# EAGLE design o32h (EAGLE 6.5.0)
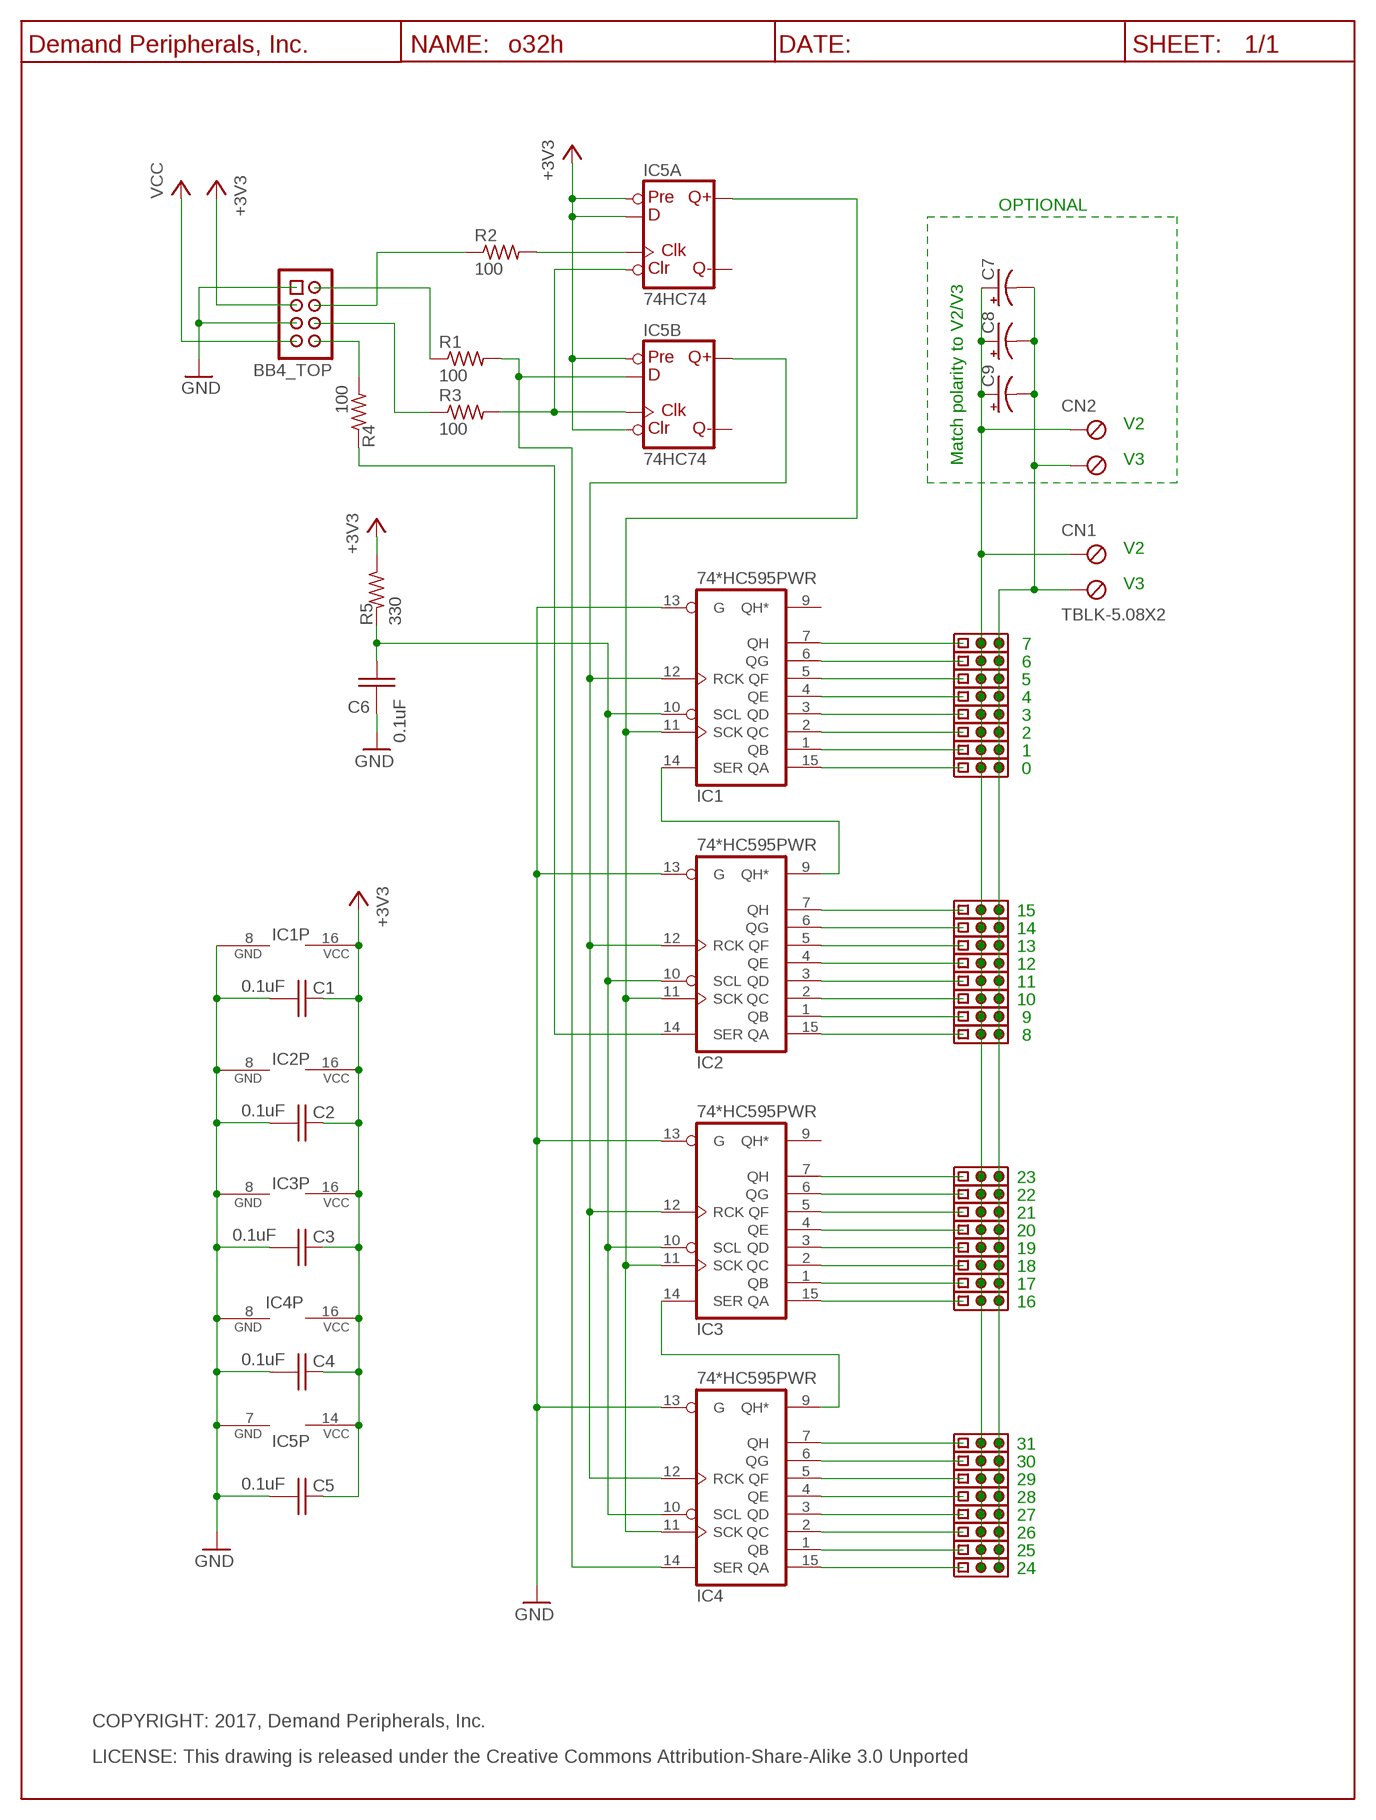
[diagram p0: schematic, sheet 1]

## Parts
BB4_TOP  Keyed_Pin_Header_4x2(0.1"x0.1")  HDR-4X2-SHR  [HDR-4X2]
C1  0.1uF  C0.1UF_C0603  [C0603]
C2  0.1uF  C0.1UF_C0603  [C0603]
C3  0.1uF  C0.1UF_C0603  [C0603]
C4  0.1uF  C0.1UF_C0603  [C0603]
C5  0.1uF  C0.1UF_C0603  [C0603]
C6  0.1uF  C0.1UF_C0603  [C0603]
C7  OPTIONAL  C1500UF35V_E7,5-16  [E7,5-16]
C8  OPTIONAL  C1500UF35V_E7,5-16  [E7,5-16]
C9  OPTIONAL  C1500UF35V_E7,5-16  [E7,5-16]
CN1  TBLK-5.08X2  TBLK-5.08-X2  [TBLK-5.08-X2]
CN2  TBLK-5.08X2  TBLK-5.08-X2  [TBLK-5.08-X2]
IC1  74*HC595PWR  74595  [SO16]
IC2  74*HC595PWR  74595  [SO16]
IC3  74*HC595PWR  74595  [SO16]
IC4  74*HC595PWR  74595  [SO16]
IC5  74HC74  74AHC74SS  [SO14]
R1  100  R100_R0603  [R0603]
R2  100  R100_R0603  [R0603]
R3  100  R100_R0603  [R0603]
R4  100  R100_R0603  [R0603]
R5  330  R330_R0603  [R0603]
U$2  DP_FRAME_P  [P_FRAME]
U$8  HDR-3X1  [HDR-3X1]
U$9  HDR-3X1  [HDR-3X1]
U$10  HDR-3X1  [HDR-3X1]
U$11  HDR-3X1  [HDR-3X1]
U$12  HDR-3X1  [HDR-3X1]
U$13  HDR-3X1  [HDR-3X1]
U$14  HDR-3X1  [HDR-3X1]
U$15  HDR-3X1  [HDR-3X1]
U$16  HDR-3X1  [HDR-3X1]
U$17  HDR-3X1  [HDR-3X1]
U$18  HDR-3X1  [HDR-3X1]
U$19  HDR-3X1  [HDR-3X1]
U$20  HDR-3X1  [HDR-3X1]
U$21  HDR-3X1  [HDR-3X1]
U$22  HDR-3X1  [HDR-3X1]
U$23  HDR-3X1  [HDR-3X1]
U$24  HDR-3X1  [HDR-3X1]
U$25  HDR-3X1  [HDR-3X1]
U$26  HDR-3X1  [HDR-3X1]
U$27  HDR-3X1  [HDR-3X1]
U$28  HDR-3X1  [HDR-3X1]
U$29  HDR-3X1  [HDR-3X1]
U$30  HDR-3X1  [HDR-3X1]
U$31  HDR-3X1  [HDR-3X1]
U$32  HDR-3X1  [HDR-3X1]
U$33  HDR-3X1  [HDR-3X1]
U$34  HDR-3X1  [HDR-3X1]
U$35  HDR-3X1  [HDR-3X1]
U$36  HDR-3X1  [HDR-3X1]
U$37  HDR-3X1  [HDR-3X1]
U$38  HDR-3X1  [HDR-3X1]
U$39  HDR-3X1  [HDR-3X1]

## Nets
+3V3: BB4_TOP.3 C1.1 C2.1 C3.1 C4.1 C5.1 IC1.16(VCC) IC2.16(VCC) IC3.16(VCC) IC4.16(VCC) IC5.2(A:D) IC5.4(A:PRE) IC5.10(B:PRE) IC5.13(B:CLR) IC5.14(P:VCC) R5.1
GND: BB4_TOP.1 BB4_TOP.5 C1.2 C2.2 C3.2 C4.2 C5.2 C6.2 IC1.8(GND) IC1.13(G) IC2.8(GND) IC2.13(G) IC3.8(GND) IC3.13(G) IC4.8(GND) IC4.13(G) IC5.7(P:GND)
N$1: BB4_TOP.8 R4.2
N$2: IC1.7(QH) U$8.1
N$3: IC1.12(RCK) IC2.12(RCK) IC3.12(RCK) IC4.12(RCK) IC5.9(B:Q)
N$4: IC1.11(SCK) IC2.11(SCK) IC3.11(SCK) IC4.11(SCK) IC5.5(A:Q)
N$7: IC1.6(QG) U$9.1
N$8: IC1.5(QF) U$10.1
N$9: IC1.4(QE) U$11.1
N$10: IC1.3(QD) U$12.1
N$12: IC1.2(QC) U$13.1
N$13: IC1.1(QB) U$14.1
N$14: IC1.15(QA) U$15.1
N$15: IC2.7(QH) U$16.1
N$16: IC2.6(QG) U$17.1
N$17: IC2.5(QF) U$18.1
N$18: IC2.4(QE) U$19.1
N$19: IC2.3(QD) U$20.1
N$20: IC2.2(QC) U$21.1
N$21: IC2.1(QB) U$22.1
N$22: IC2.15(QA) U$23.1
N$23: IC3.7(QH) U$24.1
N$24: IC3.6(QG) U$25.1
N$25: IC3.5(QF) U$26.1
N$26: IC3.4(QE) U$27.1
N$28: IC3.3(QD) U$28.1
N$29: IC3.2(QC) U$29.1
N$30: BB4_TOP.2 R1.1
N$31: IC3.1(QB) U$30.1
N$34: IC5.3(A:CLK) R2.2
N$35: IC4.14(SER) IC5.12(B:D) R1.2
N$36: IC5.1(A:CLR) IC5.11(B:CLK) R3.2
N$37: IC2.14(SER) R4.1
N$38: BB4_TOP.6 R3.1
N$39: IC3.14(SER) IC4.9(QH*)
N$41: BB4_TOP.4 R2.1
N$65: IC3.15(QA) U$31.1
N$66: C6.1 IC1.10(SCL) IC2.10(SCL) IC3.10(SCL) IC4.10(SCL) R5.2
N$67: IC4.7(QH) U$32.1
N$76: IC4.6(QG) U$33.1
N$98: IC4.5(QF) U$34.1
N$99: IC4.4(QE) U$35.1
N$100: IC4.3(QD) U$36.1
N$101: IC4.2(QC) U$37.1
N$102: IC4.1(QB) U$38.1
N$103: IC4.15(QA) U$39.1
N$108: IC1.14(SER) IC2.9(QH*)
V2: C7.+ C8.+ C9.+ CN1.1(KL) CN2.1(KL) U$8.2 U$9.2 U$10.2 U$11.2 U$12.2 U$13.2 U$14.2 U$15.2 U$16.2 U$17.2 U$18.2 U$19.2 U$20.2 U$21.2 U$22.2 U$23.2 U$24.2 U$25.2 U$26.2 U$27.2 U$28.2 U$29.2 U$30.2 U$31.2 U$32.2 U$33.2 U$34.2 U$35.2 U$36.2 U$37.2 U$38.2 U$39.2
V3: C7.- C8.- C9.- CN1.2(KL1) CN2.2(KL1) U$8.3 U$9.3 U$10.3 U$11.3 U$12.3 U$13.3 U$14.3 U$15.3 U$16.3 U$17.3 U$18.3 U$19.3 U$20.3 U$21.3 U$22.3 U$23.3 U$24.3 U$25.3 U$26.3 U$27.3 U$28.3 U$29.3 U$30.3 U$31.3 U$32.3 U$33.3 U$34.3 U$35.3 U$36.3 U$37.3 U$38.3 U$39.3
VCC: BB4_TOP.7
Unconnected: IC1.9(QH*) IC3.9(QH*) IC5.6(A:!Q) IC5.8(B:!Q)

## Notes on the sheet
- OPTIONAL
- V2
- Match polarity to V2/V3 | V3
- V2
- V3
- 7
- 6
- 5
- 4
- 3
- 2
- 1
- 0
- 15
- 14
- 13
- 12
- 11
- 10
- 9
- 8
- 23
- 22
- 21
- 20
- 19
- 18
- 17
- 16
- 31
- 30
- 29
- 28
- 27
- 26
- 25
- 24
- COPYRIGHT: 2017, Demand Peripherals, Inc.
- LICENSE: This drawing is released under the Creative Commons Attribution-Share-Alike 3.0 Unported

## Library data of the parts
BB4_TOP = dpi-conn:HDR-4X2-SHR: Shrouded 4x2 pin header; VENDOR: Digikey; VENDOR-PART-NUM: 609-3530-ND
C1-C6 = dpi-passive:C0.1UF_: 0.1 uF Capacitor, 25V, X7R; VENDOR: Digikey; VENDOR-PART-NUM: 1276-1126-2-ND
C7-C9 = dpi-passive:C1500UF35V_: 1500uF polarized capacitor, 35 volts, general purpose; VENDOR: Digikey; VENDOR-PART-NUM: 399-6559-ND
CN1 CN2 = dpi-conn:TBLK-5.08-X2: Terminal Block, 5.08mm, x2, screw terminals; VENDOR: Digikey; VENDOR-PART-NUM: ED2609-ND
IC1-IC4 = dpi-transic:74*595: 8-bit SHIFT REGISTER, output latch; VENDOR: Digikey; VENDOR-PART-NUM: 74HC595D(BJ)CT-ND
IC5 = dpi-transic:74AHC74: Dual D type positive edge triggered FLIP FLOP, preset and clear; VENDOR: Digikey; VENDOR-PART-NUM: 568-4458-1-ND
R1-R4 = dpi-passive:R100_: 100 Ohm resistor, 1%, 0.1 watt; VENDOR: Digikey; VENDOR-PART-NUM: 311-100HRTR-ND
R5 = dpi-passive:R330_: 330 Ohm resistor, 1%, 0.1 watt; VENDOR: Digikey; VENDOR-PART-NUM: 311-330HRTR-ND
U$2 = dpi-sym:DP_FRAME_P: Portrait/Letter Document Frame
U$8-U$39 = dpi-conn:HDR-3X1: 3 pin header on 0.1 inch centers, no shroud, no lock; VENDOR: Digikey; VENDOR-PART-NUM: 952-2264-ND

## Board
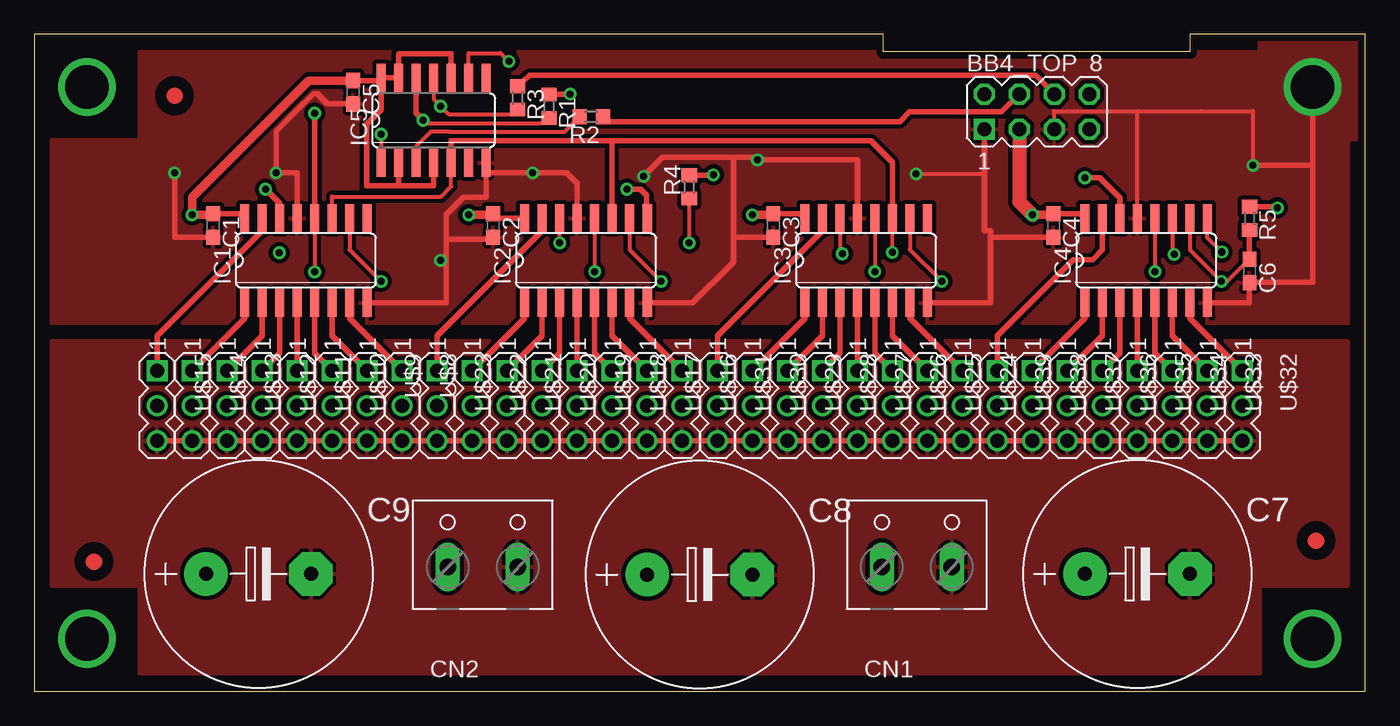
[diagram p1: board, top side]
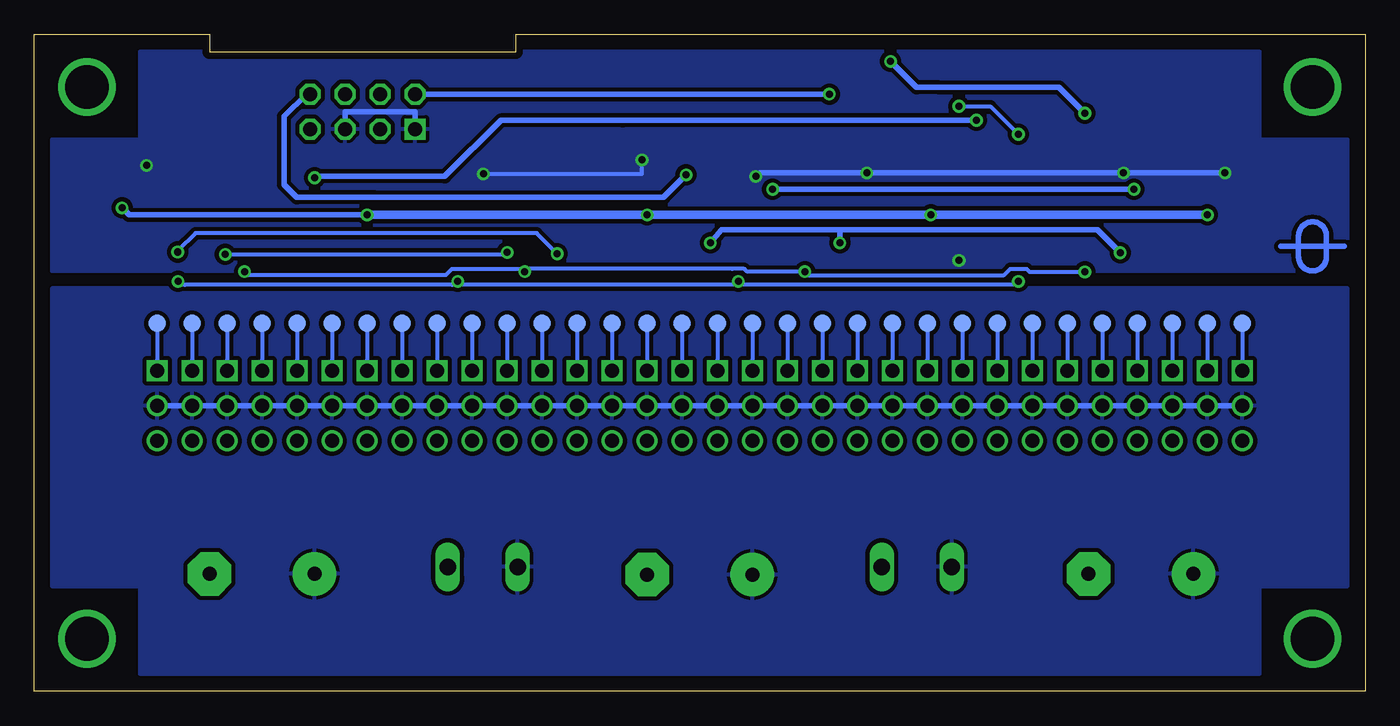
[diagram p2: board, bottom side, seen from below]

Size 96.52 x 47.62 mm. Coordinates in mm from the lower left corner, seen from the top.
Outline: 0,0 96.52,0 96.52,47.62 83.82,47.62 83.82,46.35 61.59,46.35 61.59,47.62 0,47.62 0,0
Copper layers (1*16): Top 0.035mm / dielectric 1.5mm / Bottom 0.035mm
Design rules "default *": minimum track width 10mil, minimum drill 20mil, track to track 12mil, track to pad 12mil, pad to pad 12mil, via to via 12mil, smd to smd 12mil, copper to edge 20mil, drill to drill 12mil, minimum pad ring 10mil, minimum via ring 8mil, stop-mask expansion 4mil, vias tented up to drill 25mil, thermal gap 10mil

### Footprints (pad centres in the part's own frame; a part is rotated, then mirrored left to right if it is on the bottom)
HDR-4X2 = drill 1.016 square: 1 -3.81,-1.27 | drill 1.016 octagon: 2 -3.81,1.27; 3 -1.27,-1.27; 4 -1.27,1.27; 5 1.27,-1.27; 6 1.27,1.27; 7 3.81,-1.27; 8 3.81,1.27
C0603 = smd 1.1 x 1: 1 -0.85,0; 2 0.85,0
E7,5-16 = drill 1.016 pad 3.15: + -3.81,0 | drill 1.016 pad 3.15 octagon: - 3.81,0
TBLK-5.08-X2 = drill 1.194 long: 1 -2.54,-0.127; 2 2.54,-0.127
TEST-POINT = smd 1.27 x 1.27: P1 0,0
SO16 = smd 0.66 x 2.032: 1 -4.445,-3.073; 2 -3.175,-3.073; 3 -1.905,-3.073; 4 -0.635,-3.073; 5 0.635,-3.073; 6 1.905,-3.073; 7 3.175,-3.073; 8 4.445,-3.073; 9 4.445,3.073; 10 3.175,3.073; 11 1.905,3.073; 12 0.635,3.073; 13 -0.635,3.073; 14 -1.905,3.073; 15 -3.175,3.073; 16 -4.445,3.073
SO14 = smd 0.66 x 2.032: 1 -3.81,-3.073; 2 -2.54,-3.073; 3 -1.27,-3.073; 4 0,-3.073; 5 1.27,-3.073; 6 2.54,-3.073; 7 3.81,-3.073; 8 3.81,3.073; 9 2.54,3.073; 10 1.27,3.073; 11 0,3.073; 12 -1.27,3.073; 13 -2.54,3.073; 14 -3.81,3.073
R0603 = smd 1 x 1.1: 1 -0.85,0; 2 0.85,0
HDR-3X1 = drill 1.016 square: 1 -2.54,0 | drill 1.016: 2 0,0; 3 2.54,0

### Placement (x,y rotation side)
BB4_TOP  72.71,42.04 0 top
C1  12.95,33.78 270 top
C2  33.27,33.78 270 top
C3  53.59,33.78 270 top
C4  73.91,33.78 270 top
C5  23.11,43.43 270 top
C6  88.14,30.48 270 top
C7  80.01,8.51 0 top
C8  48.26,8.46 0 top
C9  16.26,8.51 0 top
CN1  64.01,9.14 0 top
CN2  32.51,9.14 0 top
E$1  [TEST-POINT]  8.89,26.67 0 bottom
E$2  [TEST-POINT]  11.43,26.67 0 bottom
E$3  [TEST-POINT]  13.97,26.67 0 bottom
E$4  [TEST-POINT]  16.51,26.67 0 bottom
E$5  [TEST-POINT]  19.05,26.67 0 bottom
E$7  [TEST-POINT]  21.59,26.67 0 bottom
E$8  [TEST-POINT]  24.13,26.67 0 bottom
E$9  [TEST-POINT]  26.67,26.67 0 bottom
E$10  [TEST-POINT]  29.21,26.67 0 bottom
E$11  [TEST-POINT]  31.75,26.67 0 bottom
E$12  [TEST-POINT]  34.29,26.67 0 bottom
E$13  [TEST-POINT]  36.83,26.67 0 bottom
E$14  [TEST-POINT]  39.37,26.67 0 bottom
E$15  [TEST-POINT]  41.91,26.67 0 bottom
E$16  [TEST-POINT]  44.45,26.67 0 bottom
E$17  [TEST-POINT]  46.99,26.67 0 bottom
E$18  [TEST-POINT]  49.53,26.67 0 bottom
E$19  [TEST-POINT]  52.07,26.67 0 bottom
E$20  [TEST-POINT]  54.61,26.67 0 bottom
E$21  [TEST-POINT]  57.15,26.67 0 bottom
E$22  [TEST-POINT]  59.69,26.67 0 bottom
E$23  [TEST-POINT]  62.23,26.67 0 bottom
E$24  [TEST-POINT]  64.77,26.67 0 bottom
E$25  [P_FRAME]  0,0 0 top
E$26  [TEST-POINT]  67.31,26.67 0 bottom
E$27  [TEST-POINT]  69.85,26.67 0 bottom
E$28  [TEST-POINT]  72.39,26.67 0 bottom
E$29  [TEST-POINT]  74.93,26.67 0 bottom
E$30  [TEST-POINT]  77.47,26.67 0 bottom
E$31  [TEST-POINT]  80.01,26.67 0 bottom
E$32  [TEST-POINT]  82.55,26.67 0 bottom
E$33  [TEST-POINT]  85.09,26.67 0 bottom
E$34  [TEST-POINT]  87.63,26.67 0 bottom
IC1  19.68,31.24 0 top
IC2  40.01,31.24 0 top
IC3  60.33,31.24 0 top
IC4  80.64,31.24 0 top
IC5  28.96,41.4 0 top
R1  37.34,42.42 270 top
R2  40.39,41.66 180 top
R3  35.05,43.03 270 top
R4  47.5,36.58 90 top
R5  88.14,34.29 270 top
U$1  [P_FRAME]  0,0 0 top
U$2  -2.54,-2.54 0 top
U$4  [FIDUCIAL]  92.96,10.92 270 top
U$5  [FIDUCIAL]  4.32,9.4 0 top
U$6  [FIDUCIAL]  10.16,43.18 0 top
U$7  [DPI-1]  3.81,32.26 90 bottom
U$8  26.67,20.7 270 top
U$9  24.13,20.7 270 top
U$10  21.59,20.7 270 top
U$11  19.05,20.7 270 top
U$12  16.51,20.7 270 top
U$13  13.97,20.7 270 top
U$14  11.43,20.7 270 top
U$15  8.89,20.7 270 top
U$16  46.99,20.7 270 top
U$17  44.45,20.7 270 top
U$18  41.91,20.7 270 top
U$19  39.37,20.7 270 top
U$20  36.83,20.7 270 top
U$21  34.29,20.7 270 top
U$22  31.75,20.7 270 top
U$23  29.21,20.7 270 top
U$24  67.31,20.7 270 top
U$25  64.77,20.7 270 top
U$26  62.23,20.7 270 top
U$27  59.69,20.7 270 top
U$28  57.15,20.7 270 top
U$29  54.61,20.7 270 top
U$30  52.07,20.7 270 top
U$31  49.53,20.7 270 top
U$32  87.63,20.7 270 top
U$33  85.09,20.7 270 top
U$34  82.55,20.7 270 top
U$35  80.01,20.7 270 top
U$36  77.47,20.7 270 top
U$37  74.93,20.7 270 top
U$38  72.39,20.7 270 top
U$39  69.85,20.7 270 top

### Tracks (layer width: path | path; a pad name or v marks a point on that pad's centre or on a via)
+3V3  (via drill 0.51)
  Top 0.406: IC1.16 15.18,34.31 14.86,34.63 C1.1 | IC5.14 IC5.13 26.42,46.23 30.23,46.23 IC5.10 | C5.1 24.95,44.28 IC5.14 | IC5.2 26.42,36.65 | 26.42,36.65 24.08,36.65 24.08,41.1 25.15,42.16 IC5.14 | IC5.4 28.96,36.65 26.42,36.65 | C2.1 33.27,34.31 IC2.16 | C3.1 55.56,34.63 IC3.16 | C4.1 75.88,34.63 IC4.16 | R5.1 90.08,35.14 v90.17,35.05
  Top 0.61: C1.1 12.87,34.54 v11.43,34.54 11.43,35.81 19.9,44.28 C5.1 | v31.5,34.54 33.19,34.54 arc90 C2.1 | C3.1 53.51,34.54 v52.07,34.54 | C4.1 73.83,34.54 v72.39,34.54
  Top 1.016: BB4_TOP.3 71.44,35.5 v72.39,34.54
  Bottom 0.406: v90.17,35.05 89.66,34.54 v72.39,34.54
  Bottom 0.61: v11.43,34.54 v31.5,34.54 v52.07,34.54 v72.39,34.54
GND  (via drill 0.51, 3.17)
  Top 0.305: v63.96,37.52 68.9,37.52 68.9,37.64 | BB4_TOP.5 73.98,42.06 80.03,42.06 | 80.03,42.06 84.58,42.06 88.39,42.06 v88.39,38.12 | IC4.13 80.01,42.06 80.03,42.06
  Top 0.406: 29.84,32.77 29.84,34.54 31.11,35.81 32,35.81 32.77,35.81 IC5.7 32.77,37.59 v36.14,37.59 38.61,37.59 39.37,36.83 IC2.13 | 29.84,32.77 29.84,31.17 | 29.84,31.17 29.84,28.17 IC1.8 | C2.2 33.27,32.77 29.84,32.77 | IC1.13 19.05,37.59 v17.53,37.59 17.53,40.62 18.85,41.94 20.24,43.33 20.5,43.33 21.25,42.58 C5.2 | C1.2 10.16,32.93 v10.16,37.59 | BB4_TOP.1 68.9,37.64 68.9,33.4 69.34,33.4 | C4.2 69.34,32.93 69.34,33.4 | 69.34,33.4 69.34,28.17 IC3.8 | v92.71,43.81 92.73,43.81 92.73,37.77 | 92.73,37.77 92.73,29.64 88.14,29.64 C6.2 88.14,28.17 IC4.8 | v88.39,38.12 92.73,38.12 92.73,37.77 | v44.2,37.34 45.57,38.71 50.7,38.71 | v29.46,31.24 29.77,31.24 29.84,31.17 | C3.2 50.7,32.93 | 50.7,32.93 50.7,38.71 | IC2.8 47.75,28.17 50.52,30.94 50.7,31.11 50.7,32.93 | 50.7,38.71 52.45,38.71 v52.45,38.53 59.69,38.53 IC3.13
  Bottom 0.305: v63.96,37.52 52.45,37.52 v52.45,38.53
  Bottom 0.406: v10.16,37.59 v17.53,37.59 v36.14,37.59 43.94,37.59 v44.2,37.34 44.2,37.59 | 68.9,40.64 BB4_TOP.1 68.9,42.01 69.34,42.04 73.98,42.04 BB4_TOP.5
  pour Top: 1.27,26.67 1.27,40.01 7.62,40.01 7.62,46.35 88.9,46.35 88.9,47.12 96.01,47.12 96.01,40.01 95.25,40.01 95.25,26.67
  pour Bottom: 1.27,30.48 1.27,40.01 7.62,40.01 7.62,46.35 88.9,46.35 88.9,40.01 95.25,40.01 95.25,30.48
MOUNT0  (via drill 3.17 pad 3.17)
  other vias: 3.81,3.81
MOUNT1  (via drill 3.17 pad 3.17)
  other vias: 3.81,43.81
MOUNT6  (via drill 3.17 pad 3.17)
  other vias: 92.71,3.81
N$1  (via drill 0.51)
  Top 0.406: R4.2 49.24,37.43 v49.25,37.44
  Bottom 0.406: BB4_TOP.8 76.78,43.31 78.41,41.68 78.41,36.73 77.5,35.81 71.75,35.81 50.88,35.81 v49.25,37.44
N$2
  Top 0.406: IC1.7 22.86,27.05 U$8.1
N$3  (via drill 0.51)
  Top 0.305: IC3.12 v60.96,30.43 | IC1.12 v20.32,30.4 | IC2.12 v40.64,30.43 | IC4.12 v81.28,30.43 | IC5.9 31.5,46.28 33.76,46.28 33.81,46.28 v34.42,45.67
  Top 0.406: v20.32,41.91 IC1.12
  Bottom 0.305: v20.32,30.4 24.33,30.4 24.56,30.63 25.73,30.63 26.19,30.18 40.39,30.18 v40.64,30.43 44.83,30.43 45.01,30.61 45.03,30.63 45.9,30.63 60.76,30.63 v60.96,30.43 60.96,30.63 65.38,30.63 66.24,30.63 66.67,30.2 81.05,30.2 v81.28,30.43
  Bottom 0.406: v20.32,41.91 22.2,43.79 26.26,43.79 30.89,43.79 32.54,43.79 v34.42,45.67
N$4  (via drill 0.51)
  Top 0.305: IC1.11 21.59,35.87 29.49,35.87 30.23,36.6 IC5.5 | IC4.11 82.55,31.8 v82.68,31.67 | v62.23,31.83 IC3.11
  Top 0.406: IC5.5 30.23,39.9 37.11,39.9 39.6,39.9 41.91,39.9 | 41.91,39.9 60.68,39.9 62.23,38.35 IC3.11 | IC2.11 41.91,39.9
  Bottom 0.305: v82.68,31.67 62.38,31.67 v62.23,31.83
N$7
  Top 0.406: IC1.6 21.59,25.78 U$9.1
N$8
  Top 0.406: IC1.5 20.32,24.51 U$10.1
N$9
  Top 0.406: IC1.4 U$11.1
N$10
  Top 0.406: IC1.3 17.78,24.51 U$12.1
N$12
  Top 0.406: IC1.2 16.51,25.78 U$13.1
N$13
  Top 0.406: IC1.1 15.24,27.05 U$14.1
N$14
  Top 0.406: IC1.15 16.51,33.4 8.89,25.78 U$15.1
N$15
  Top 0.406: IC2.7 43.18,27.05 U$16.1
N$16
  Top 0.406: IC2.6 41.91,25.78 U$17.1
N$17
  Top 0.406: IC2.5 40.64,24.51 U$18.1
N$18
  Top 0.406: IC2.4 U$19.1
N$19
  Top 0.406: IC2.3 38.1,24.51 U$20.1
N$20
  Top 0.406: IC2.2 36.83,25.78 U$21.1
N$21
  Top 0.406: IC2.1 35.56,27.05 U$22.1
N$22
  Top 0.406: IC2.15 36.83,33.4 29.21,25.78 U$23.1
N$23
  Top 0.406: IC3.7 63.5,27.05 U$24.1
N$24
  Top 0.406: IC3.6 62.23,25.78 U$25.1
N$25
  Top 0.406: IC3.5 60.96,24.51 U$26.1
N$26
  Top 0.406: IC3.4 U$27.1
N$28
  Top 0.406: IC3.3 58.42,24.51 U$28.1
N$29
  Top 0.406: IC3.2 57.15,25.78 U$29.1
N$30  (via drill 0.51)
  Top 0.406: 37.67,43.28 R1.1 37.38,43.31 v38.86,43.31
  Bottom 0.406: BB4_TOP.2 v38.86,43.31
N$31
  Top 0.406: IC3.1 55.88,27.05 U$30.1
N$32
  Bottom 0.305: 11.43,26.16 11.43,24
N$34
  Top 0.305: R2.2 38.44,40.56 30.1,40.56 28.73,40.56 27.69,39.52 IC5.3
N$35  (via drill 0.51)
  Top 0.305: v28.19,41.4 28.42,41.2 36.75,41.2 37.2,41.57 R1.2
  Top 0.406: IC5.12 27.69,41.91 v28.19,41.4 | v76.2,37.24 77.29,37.24 78.59,35.94 78.74,35.79 IC4.14
  Bottom 0.406: v28.19,41.4 53.85,41.4 62.69,41.4 66.75,37.34 76.1,37.34 v76.2,37.24
N$36  (via drill 0.51)
  Top 0.305: R3.2 34.73,41.81 30.73,41.81 30.07,41.81 v29.46,42.42 28.96,42.93 IC5.11 | v25.15,40.39 IC5.1
  Bottom 0.305: v29.46,42.42 27.18,42.42 v25.15,40.39
N$37  (via drill 0.51)
  Top 0.305: v38.1,32.51 IC2.14 | R4.1 v47.5,32.51
  Bottom 0.406: 38.1,33.45 38.79,33.45 | 38.79,33.45 46.69,33.45 v47.5,32.51 | v38.1,32.51 38.1,33.45 | 38.1,33.45 38.79,33.45 | 38.1,33.45 19.41,33.45 v17.75,31.8
N$38
  Top 0.406: R3.1 35.93,44.65 72.64,44.65 BB4_TOP.6
N$39  (via drill 0.51)
  Top 0.305: IC3.14 58.42,31.9 v58.6,31.73 | v86.13,31.85 85.09,32.89 IC4.9
  Bottom 0.305: v58.6,31.73 60.1,33.22 84.84,33.22 86.13,31.93 v86.13,31.85
N$41
  Top 0.406: BB4_TOP.4 70.14,42.04 63.48,42.04 62.76,41.3 42.27,41.3 41.24,41.3 R2.1
N$42
  Bottom 0.305: 13.97,26.16 13.97,24
N$56
  Bottom 0.305: 16.51,26.16 16.51,24
N$61
  Bottom 0.305: 19.05,26.16 19.05,24
N$65
  Top 0.406: IC3.15 57.15,33.4 49.53,25.78 U$31.1
N$66  (via drill 0.51)
  Top 0.305: IC2.10 43.18,32 v45.47,29.72 | IC1.10 22.86,32 v25.15,29.72 | C6.1 86.53,29.72 v86.11,29.72 83.82,32 IC4.10 | IC3.10 63.5,32.03 v65.81,29.72
  Top 0.406: R5.2 C6.1
  Bottom 0.305: v25.15,29.72 25.15,29.46 45.52,29.46 | 45.52,29.46 66.19,29.46 | 66.19,29.46 85.6,29.46 86.11,29.46 v86.11,29.72 | v65.81,29.72 65.81,29.46 66.19,29.46 | v45.47,29.72 45.47,29.46 45.52,29.46
N$67
  Top 0.406: IC4.7 83.82,27.05 U$32.1
N$72
  Bottom 0.305: 21.59,26.16 21.59,24
N$74
  Bottom 0.305: 24.13,26.16 24.13,24
N$76
  Top 0.406: IC4.6 82.55,25.78 U$33.1
N$77
  Bottom 0.305: 26.67,26.16 26.67,24
N$78
  Bottom 0.305: 29.21,26.16 29.21,24
N$79
  Bottom 0.305: 31.75,26.16 31.75,24
N$80
  Bottom 0.305: 34.29,26.16 34.29,24
N$81
  Bottom 0.305: 36.83,26.16 36.83,24
N$82
  Bottom 0.305: 39.37,26.16 39.37,24
N$83
  Bottom 0.305: 41.91,26.16 41.91,24
N$84
  Bottom 0.305: 44.45,26.16 44.45,24
N$85
  Bottom 0.305: 49.53,26.16 49.53,24
N$86
  Bottom 0.305: 52.07,26.16 52.07,24
N$87
  Bottom 0.305: 54.61,26.16 54.61,24
N$88
  Bottom 0.305: 57.15,26.16 57.15,24
N$89
  Bottom 0.305: 59.69,26.16 59.69,24
N$90
  Bottom 0.305: 62.23,26.16 62.23,24
N$91
  Bottom 0.305: 64.77,26.16 64.77,24
N$92
  Bottom 0.305: 67.31,26.16 67.31,24
N$93
  Bottom 0.305: 69.85,26.16 69.85,24
N$94
  Bottom 0.305: 72.39,26.16 72.39,24
N$95
  Bottom 0.305: 74.93,26.16 74.93,24
N$96
  Bottom 0.305: 77.47,26.16 77.47,24
N$97
  Bottom 0.305: 80.01,26.16 80.01,24
N$98
  Top 0.406: IC4.5 81.28,24.51 U$34.1
N$99
  Top 0.406: IC4.4 U$35.1
N$100
  Top 0.406: IC4.3 78.74,24.51 U$36.1
N$101
  Top 0.406: IC4.2 77.47,25.78 U$37.1
N$102
  Top 0.406: IC4.1 76.2,27.05 U$38.1
N$103
  Top 0.406: U$39.1 69.85,25.78 75.36,31.29 76.76,31.29 77.47,32 IC4.15
N$104
  Bottom 0.305: 82.55,26.16 82.55,24
N$105
  Bottom 0.305: 85.09,26.16 85.09,24
N$106
  Bottom 0.305: 46.99,26.16 46.99,24
N$108  (via drill 0.51)
  Top 0.406: IC1.14 17.78,35.38 v16.76,36.4 | v42.98,36.4 43.97,36.4 44.4,35.97 44.4,34.37 IC2.9
  Bottom 0.406: v16.76,36.4 v42.98,36.4
S$1
  Bottom 0.305: 8.89,26.16 8.89,24
S$2
  Bottom 0.305: 87.63,26.16 87.63,24
V2
  Bottom 0.406: U$15.2 U$14.2 U$13.2 U$12.2 U$11.2 U$10.2 U$9.2 U$8.2 U$23.2 U$22.2 U$21.2 U$20.2 U$19.2 U$18.2 U$17.2 U$16.2 U$31.2 U$30.2 U$29.2 U$28.2 U$27.2 U$26.2 U$25.2 U$24.2 U$39.2 U$38.2 U$37.2 U$36.2 U$35.2 U$34.2 U$33.2 U$32.2
  pour Bottom: 1.27,7.62 1.27,29.21 95.25,29.21 95.25,7.62 88.9,7.62 88.9,1.27 7.62,1.27 7.62,7.62
V3
  Top 0.406: U$32.3 U$33.3 U$34.3 U$35.3 U$36.3 U$37.3 U$38.3 U$39.3 U$24.3 U$25.3 U$26.3 U$27.3 U$28.3 U$29.3 U$30.3 U$31.3 U$16.3 U$17.3 U$18.3 U$19.3 U$20.3 U$21.3 U$22.3 U$23.3 U$8.3 U$9.3 U$10.3 U$11.3 U$12.3 U$13.3 U$14.3 U$15.3
  pour Top: 1.27,7.62 1.27,25.4 95.25,25.4 95.25,7.62 88.9,7.62 88.9,1.27 7.62,1.27 7.62,7.62

### Text on the board
tTest: 3.8 Inches | 3.5 Inches | BB4 | O32H, Rev 17A | R1 | C5 | (C) 2017, Demand Peripherals, Inc. | R2 | R3 | IC5 | R4 | R5 | C1 | C2 | C3 | C4 | C6 | IC1 | IC2 | IC3 | IC4 | 0 | 4 | 8 | 12 | 16 | 20 | 24 | 28 | 31 | 1 | 1 | 2 | 2 | 3 | 3 | 1.575 Inches | 1.875 Inches | 0 | 4 | 8 | 12 | 16 | 20 | 24 | 28 | 31 | C7 | C9 | C8 | OPTIONAL | OPTIONAL | OPTIONAL | V2 | V3 | V2 | V3